# Altium project PCB_Project.PrjPcb
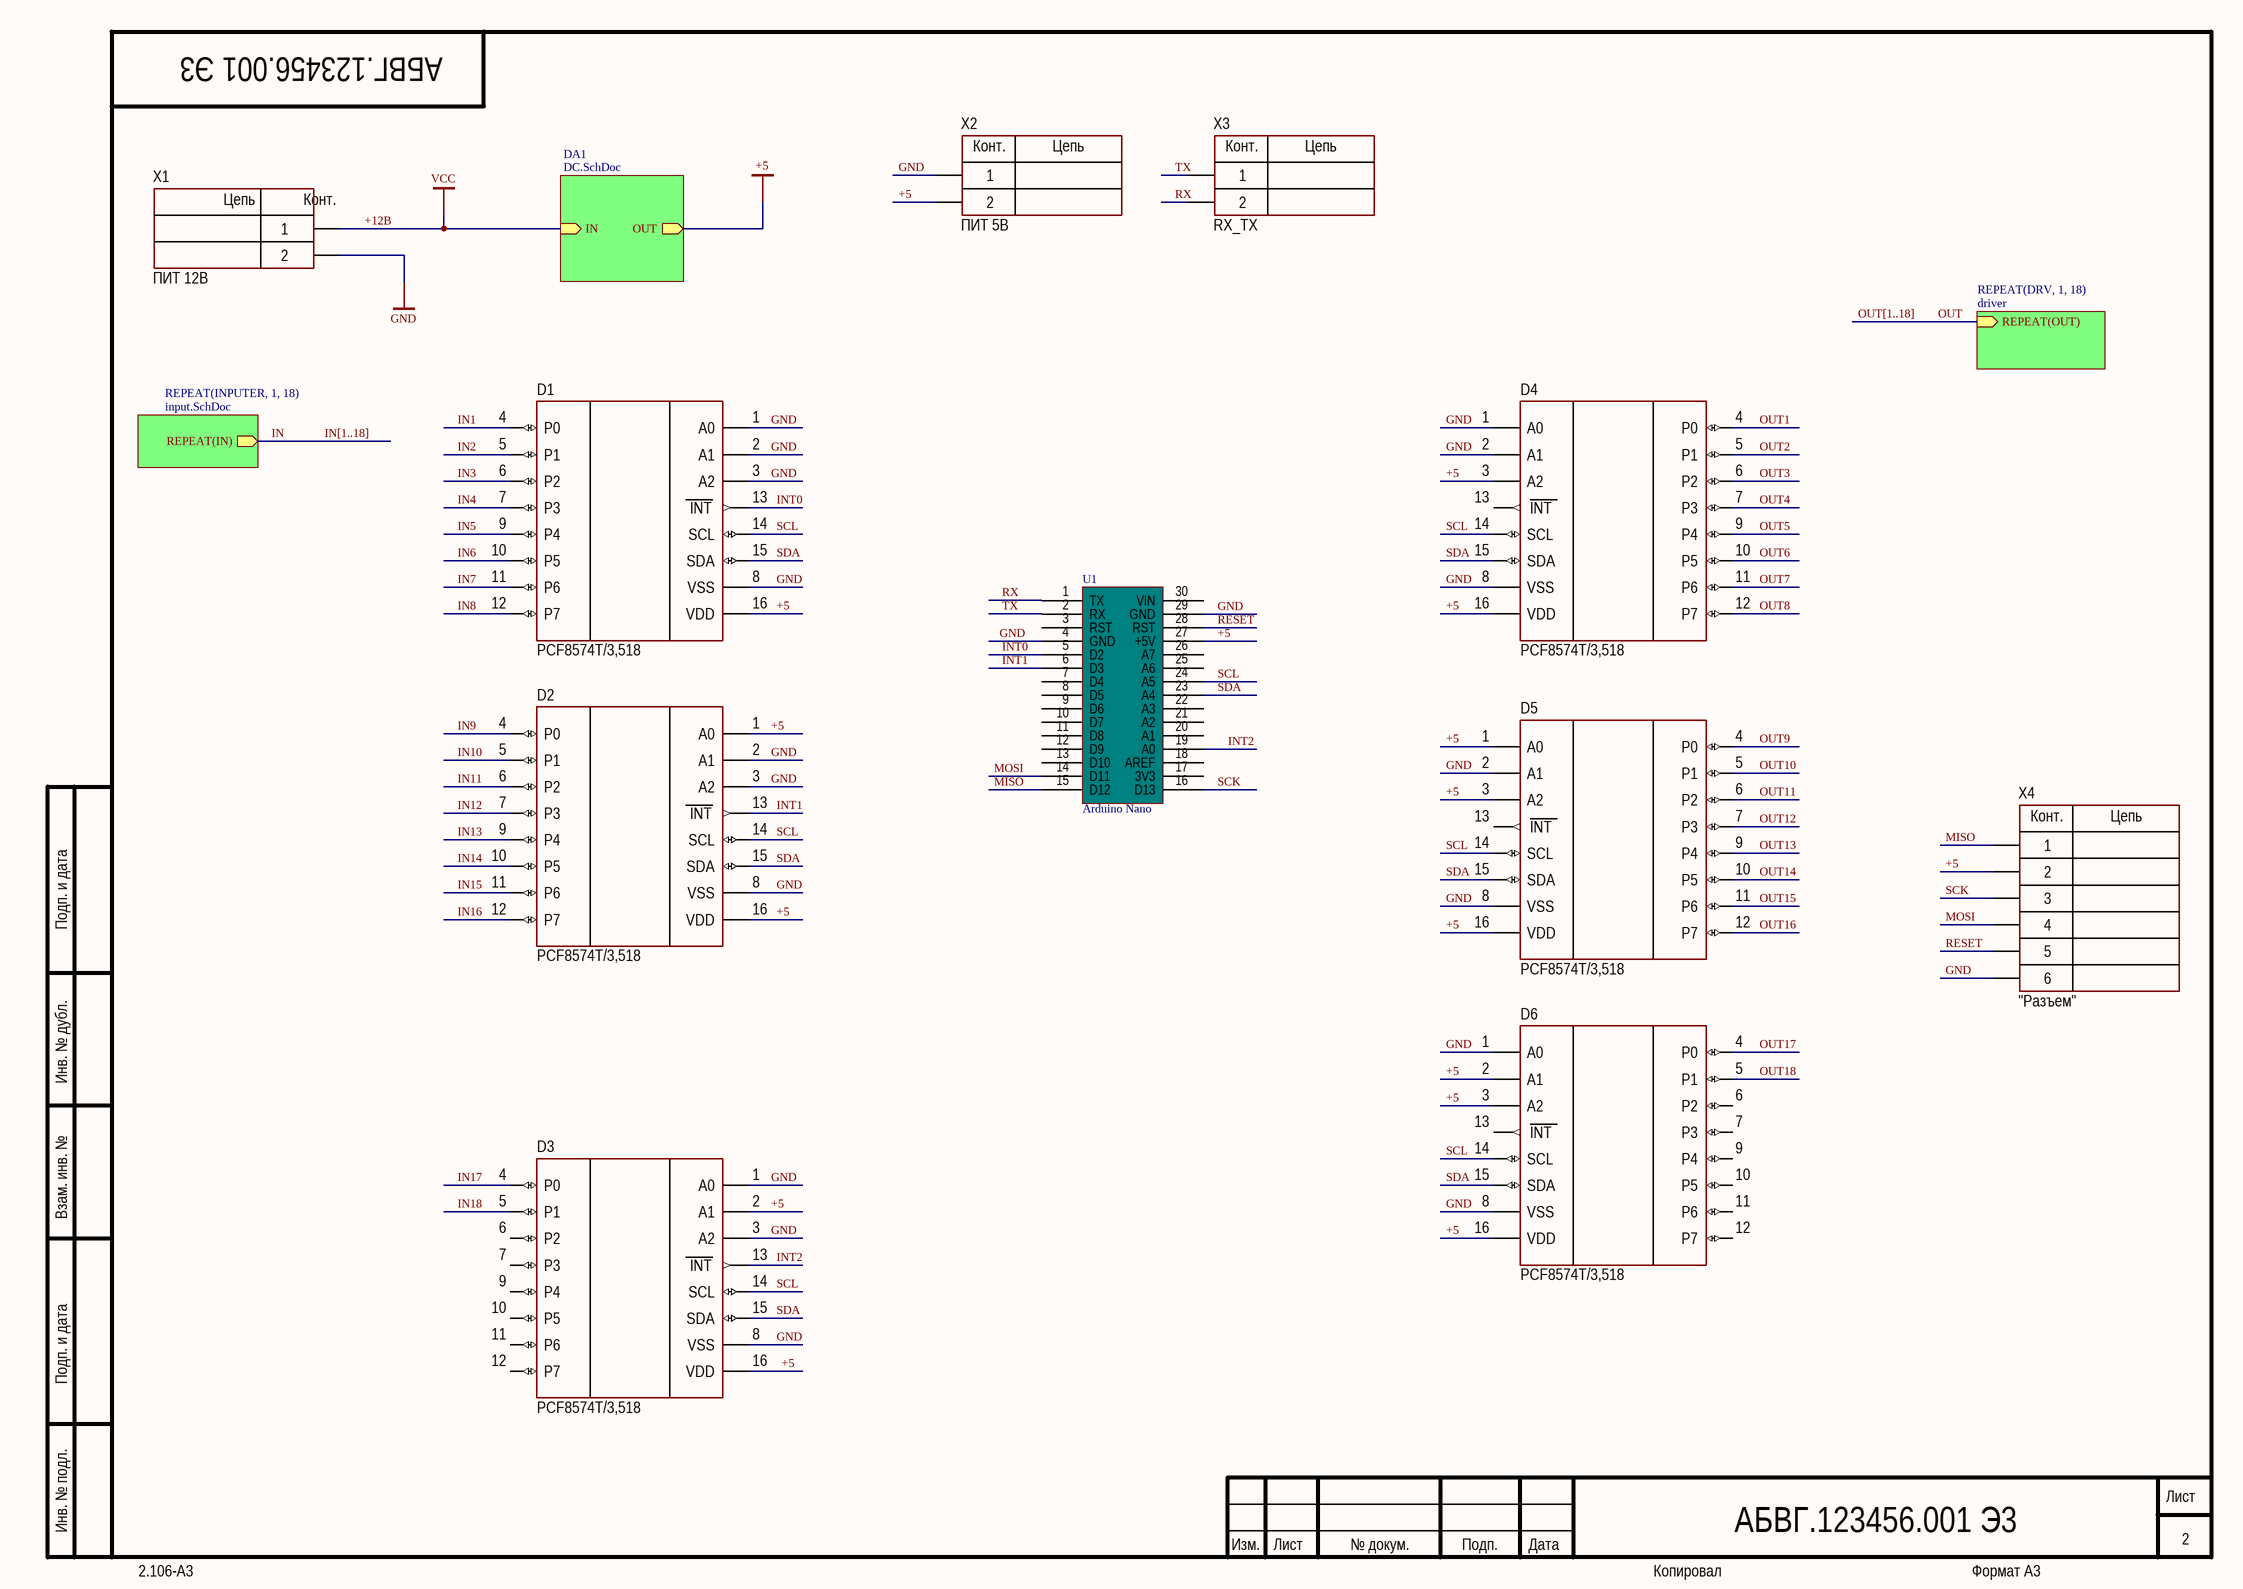
[diagram p0: Sheet1.SchDoc]
4 sheets, 176 parts. Net scope: hierarchical (ports join the sheet entries above them; power ports are global).
Board file: PCB1.PcbDoc
Sheets:
  Sheet1.SchDoc
    DA1 = DC.SchDoc
    INPUTER1 = input.SchDoc
    INPUTER2 = input.SchDoc
    INPUTER3 = input.SchDoc
    INPUTER4 = input.SchDoc
    INPUTER5 = input.SchDoc
    INPUTER6 = input.SchDoc
    INPUTER7 = input.SchDoc
    INPUTER8 = input.SchDoc
    INPUTER9 = input.SchDoc
    INPUTER10 = input.SchDoc
    INPUTER11 = input.SchDoc
    INPUTER12 = input.SchDoc
    INPUTER13 = input.SchDoc
    INPUTER14 = input.SchDoc
    INPUTER15 = input.SchDoc
    INPUTER16 = input.SchDoc
    INPUTER17 = input.SchDoc
    INPUTER18 = input.SchDoc
    DRV1 = driver.SchDoc
    DRV2 = driver.SchDoc
    DRV3 = driver.SchDoc
    DRV4 = driver.SchDoc
    DRV5 = driver.SchDoc
    DRV6 = driver.SchDoc
    DRV7 = driver.SchDoc
    DRV8 = driver.SchDoc
    DRV9 = driver.SchDoc
    DRV10 = driver.SchDoc
    DRV11 = driver.SchDoc
    DRV12 = driver.SchDoc
    DRV13 = driver.SchDoc
    DRV14 = driver.SchDoc
    DRV15 = driver.SchDoc
    DRV16 = driver.SchDoc
    DRV17 = driver.SchDoc
    DRV18 = driver.SchDoc

## Sheet Sheet1.SchDoc
size 420 x 297 mm; Address1: Address1; Address2: Address2; Address3: Address3; Address4: Address4; DocumentNumber: АБВГ.123456.001 Э3; SheetNumber: 2; Scale: 1:1; DocumentType: Схема электрическая принципиальная; FirstReferrence: АБВГ.123456.001

### Parts
D1  PartNumber: PCF8574T/3,518  [16-TSSOP]
D2  PartNumber: PCF8574T/3,518  [16-TSSOP]
D3  PartNumber: PCF8574T/3,518  [16-TSSOP]
D4  PartNumber: PCF8574T/3,518  [16-TSSOP]
D5  PartNumber: PCF8574T/3,518  [16-TSSOP]
D6  PartNumber: PCF8574T/3,518  [16-TSSOP]
U1  Arduino Nano  [CON: ArduinoNano]
X1  CommentText: ПИТ 12В  [TB_2_2.5MM]
X2  CommentText: ПИТ 5В  [TB_2_2.5MM]
X3  CommentText: RX_TX  [TB_2_2.5MM]
X4  CommentText: "Разъем"  [CON: PLD-6]

### Sub-sheets
DA1 = DC.SchDoc: IN (in), OUT (out)
REPEAT(DRV, 1, 18) = driver: REPEAT(OUT) (in)
REPEAT(INPUTER, 1, 18) = input.SchDoc: REPEAT(IN) (out)

### Nets
+5: D1.16(VDD) D2.1(A0) D2.16(VDD) D3.2(A1) D3.16(VDD) D4.3(A2) D4.16(VDD) D5.1(A0) D5.3(A2) D5.16(VDD) D6.2(A1) D6.3(A2) D6.16(VDD) U1.27(+5V) X2.2 X4.2 ; sheet DA1/OUT
+12В: X1.1 ; sheet DA1/IN  [also labelled VCC]
GND: D1.1(A0) D1.2(A1) D1.3(A2) D1.8(VSS) D2.2(A1) D2.3(A2) D2.8(VSS) D3.1(A0) D3.3(A2) D3.8(VSS) D4.1(A0) D4.2(A1) D4.8(VSS) D5.2(A1) D5.8(VSS) D6.1(A0) D6.8(VSS) U1.4(GND) U1.29(GND) X1.2 X2.1 X4.6
IN: sheet REPEAT(INPUTER, 1, 18)/REPEAT(IN)
IN1: D1.4(P0)
IN2: D1.5(P1)
IN3: D1.6(P2)
IN4: D1.7(P3)
IN5: D1.9(P4)
IN6: D1.10(P5)
IN7: D1.11(P6)
IN8: D1.12(P7)
IN9: D2.4(P0)
IN10: D2.5(P1)
IN11: D2.6(P2)
IN12: D2.7(P3)
IN13: D2.9(P4)
IN14: D2.10(P5)
IN15: D2.11(P6)
IN16: D2.12(P7)
IN17: D3.4(P0)
IN18: D3.5(P1)
INT0: D1.13(INT) U1.5(D2)
INT1: D2.13(INT) U1.6(D3)
INT2: D3.13(INT) U1.19(A0)
MISO: U1.15(D12) X4.1
MOSI: U1.14(D11) X4.4
OUT: sheet REPEAT(DRV, 1, 18)/REPEAT(OUT)
OUT1: D4.4(P0)
OUT2: D4.5(P1)
OUT3: D4.6(P2)
OUT4: D4.7(P3)
OUT5: D4.9(P4)
OUT6: D4.10(P5)
OUT7: D4.11(P6)
OUT8: D4.12(P7)
OUT9: D5.4(P0)
OUT10: D5.5(P1)
OUT11: D5.6(P2)
OUT12: D5.7(P3)
OUT13: D5.9(P4)
OUT14: D5.10(P5)
OUT15: D5.11(P6)
OUT16: D5.12(P7)
OUT17: D6.4(P0)
OUT18: D6.5(P1)
RESET: U1.28(RST) X4.5
RX: U1.1(TX) X3.2
SCK: U1.16(D13) X4.3
SCL: D1.14(SCL) D2.14(SCL) D3.14(SCL) D4.14(SCL) D5.14(SCL) D6.14(SCL) U1.24(A5)
SDA: D1.15(SDA) D2.15(SDA) D3.15(SDA) D4.15(SDA) D5.15(SDA) D6.15(SDA) U1.23(A4)
TX: U1.2(RX) X3.1

Not connected (* = marked no-connect by the designer): D3 6(P2) 7(P3) 9(P4) 10(P5) 11(P6) 12(P7); D4 13(INT); D5 13(INT); D6 6(P2) 7(P3) 9(P4) 10(P5) 11(P6) 12(P7) 13(INT); U1 3(RST) 7(D4) 8(D5) 9(D6) 10(D7) 11(D8) 12(D9) 13(D10) 17(3V3) 18(AREF) 20(A1) 21(A2) 22(A3) 25(A6) 26(A7) 30(VIN)

### Buses and harness runs
bus IN[1..18]
bus OUT[1..18]

### Notes on the sheet
- Подп. и дата
- Инв. № дубл.
- Взам. инв. №
- Инв. № подл.
- Изм.
- Лист
- № докум.
- Подп.
- Дата
- 2.106-A3
- Копировал
- Формат А3
- (in symbol DG308-2.54-02P-14-00A(H)) Конт.; Цепь
- (in symbol PLD-6) Конт.; Цепь

### Library data of the parts
D1-D6 = PCF8574T/3,518: Расширитель цифровых входов/выходов для шины I2C; Manufacturer: NXP Semiconductor; ValueManufacturerPartNumber: IC logic buffer, 2...6V, -40...+125°C, 20-TSSOP; Supply: 2...6V; ID: 10; ElementName: PCF8574T/3,518. 8-битный расширитель портов; URL_bying: #https://www.chipdip.ru/product/pcf8574t-3.518?ysclid=luk07hbopc633637602#; HelpURL: https://www.digikey.com/product-detail/en/nexperia-usa-inc/74HC245PW118/1727-4296-1-ND/2209913; Package: 20-TSSOP; ComponentType: IC logic buffer; Temperature: -40...+125°C; Temperature Min: -40; Temperature Max: +85; ValueSCH: PCF8574T/3,518
U1 = Arduino_Nano: ID: 12; ElementName: Ардуино Нано; Partnumber: Arduino_Nano; Manufacturer: Arduino; price: ~200 ₽; ValueSCH: Arduino Nano
X1-X3 = DG308-2.54-02P-14-00A(H): Винтовой клеммный блок c рельефной обоймой, 2 контакта. Серия DG308-2.54; Manufacturer: Китай; ValueManufacturerPartNumber: Terminal connector, 2pin, 3.5mm, 300VAC, 10A; TypeConnector: Terminal connector; VoltageMax: 300VAC; Pitch: 3.5mm; CurrentMax: 10A; Multichannel: 2pin; ID: 6; ElementName: 308-021-14, Клеммник винтовой, 2-контактный, 2.54мм, прямой; ValueSCH: Клемник 308-021-14; ChipDip: #https://www.chipdip.ru/product/308-021-12-14#; HelpURL: https://www.chipdip.ru/product/dg350-3.5-02p-12; PartNumber: DG308-2.54-02P-14-00A(H); Price: 19 ₽; Last_update: 23.11.2020
X4 = PLD-6: Manufacturer: Connfly; ValueManufacturerPartNumber: Connector, 6pin, 2.54mm, 500VAC, 3A; TypeConnector: Connector; VoltageMax: 500VAC; Pitch: 2.54mm; CurrentMax: 3A; Multichannel: 6pin; ID: 7; ElementName: Разъем 6 контактный (3 контакта в 2 ряда); HelpURL: https://www.chipdip.ru/product/pld-6; PartNumber: PLD-6; ValueSCH: PLD-6; Last_update: 30.03.2021

## Sheet DC.SchDoc
size A4
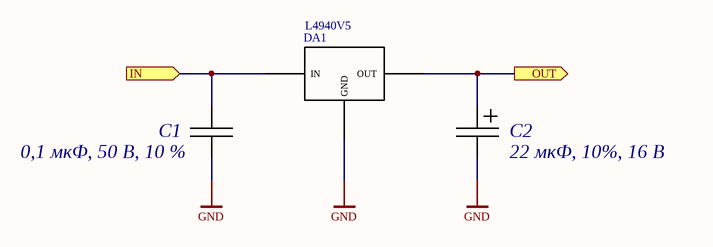
[diagram p1: DC.SchDoc]

### Parts
C1  0,1 мкФ, 50 В, 10 %  [CAP: 0805]
C2  22 мкФ, 10%, 16 В  [CAP: TANTAL-C]
DA1  L4940V5  [TO220_L]

### Ports
IN (in), OUT (out)

### Nets
+5: C2.1 DA1.3(OUT) ; port OUT
+12В: C1.2 DA1.1(IN) ; port IN
GND: C1.1 C2.2 DA1.2(GND)

### Library data of the parts
C1 = GRM21BR71H104K: Конденсатор; Manufacturer: Murata Manufacturing; ValueOther: Value; ID: 19; ChipDip: #https://www.chipdip.ru/product/grm21br71h104k#; ElementName: Кер.ЧИП конд. 0.1 мкФ X7R 50В 10% 0805, GRM21BR71H104K**; ValueSCH: 0,1 мкФ, 50 В, 10 %; Partnumber: GRM21BR71H104K; HelpURL: https://static.chipdip.ru/lib/235/DOC000235066.pdf; Temperature Min: -55; Temperature Max: +125; weight: 0,04; price: 7*10; last_update: 21.11.2020
C2 = TECAP22/16VC10: Конденсатор; Manufacturer: Китай; ID: 35; ChipDip: #https://www.chipdip.ru/product/tecap-22-mkf-16-v-tip-c-10#; ElementName: Конденсатор танталовый SMD, TECAP, 22 мкФ, 16 В, тип C, 10%; Partnumber: TECAP22/16VC10; Temperature Min: -55; Temperature Max: +125; weight: 0,15; price: 44; ValueSCH: 22 мкФ, 10%, 16 В; last_update: 12.10.2023
DA1 = L4940V5_L: LDO регуляторы напряжения 5.0V 1.5A Positive; Manufacturer: STMicroelectronics; ID: 8; ElementName: Линейный стабилизатор напряжения, +5В, 1.5 А, LDO; URL_bying: #https://www.chipdip.ru/product/l4940v5#; Partnumber: L4940V5_L; ValueSCH: L4940V5; Temperature Min: -40; Temperature Max: +150; weight: 2,5; ChipDip: #https://www.chipdip.ru/product/l4940v5#; price: 200; last_update: 12.10.2023

## Sheet input.SchDoc
size A4
Used 18 times, as channels INPUTER1, INPUTER2, INPUTER3, INPUTER4, INPUTER5, INPUTER6, INPUTER7, INPUTER8, INPUTER9, INPUTER10, INPUTER11, INPUTER12, INPUTER13, INPUTER14, INPUTER15, INPUTER16, INPUTER17, INPUTER18. Parts and nets are listed once, with the designators drawn on the sheet.
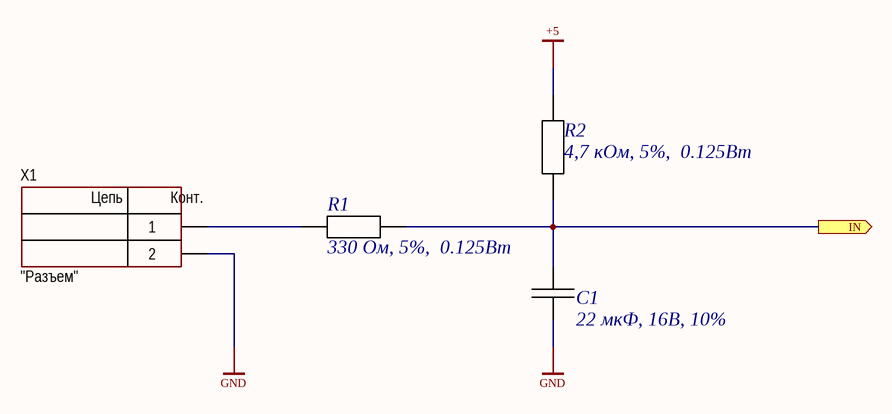
[diagram p2: input.SchDoc]

### Parts
C1  22 мкФ, 16В, 10%  [CAP: 1206]
R1  330 Ом, 5%,  0.125Вт  [RES: 0805]
R2  4,7 кОм, 5%,  0.125Вт  [RES: 0805]
X1  CommentText: "Разъем"  [TB_2_2.5MM]

### Ports
IN (out)

### Nets
+5: R2.2
GND: C1.1 X1.2
IN: C1.2 R1.2 R2.1 ; port IN
NetR1_1: R1.1 X1.1

### Channels
INPUTER1: designators end in _INPUTER1; ports IN=IN1
INPUTER2: designators end in _INPUTER2; ports IN=IN2
INPUTER3: designators end in _INPUTER3; ports IN=IN3
INPUTER4: designators end in _INPUTER4; ports IN=IN4
INPUTER5: designators end in _INPUTER5; ports IN=IN5
INPUTER6: designators end in _INPUTER6; ports IN=IN6
INPUTER7: designators end in _INPUTER7; ports IN=IN7
INPUTER8: designators end in _INPUTER8; ports IN=IN8
INPUTER9: designators end in _INPUTER9; ports IN=IN9
INPUTER10: designators end in _INPUTER10; ports IN=IN10
INPUTER11: designators end in _INPUTER11; ports IN=IN11
INPUTER12: designators end in _INPUTER12; ports IN=IN12
INPUTER13: designators end in _INPUTER13; ports IN=IN13
INPUTER14: designators end in _INPUTER14; ports IN=IN14
INPUTER15: designators end in _INPUTER15; ports IN=IN15
INPUTER16: designators end in _INPUTER16; ports IN=IN16
INPUTER17: designators end in _INPUTER17; ports IN=IN17
INPUTER18: designators end in _INPUTER18; ports IN=IN18

### Notes on the sheet
- (in symbol DG308-2.54-02P-14-00A(H)) Цепь; Конт.

### Library data of the parts
C1 = GRM31CR61C226KE15L: Конденсатор; Manufacturer: Murata Manufacturing; ValueOther: Value; ID: 29; ChipDip: #https://www.chipdip.ru/product/grm31cr61c226ke15l#; ElementName: Кер.ЧИП конд. 22 мкФ X5R 10% 16В 1206, GRM31CR61C226KE15L*; ValueSCH: 22 мкФ, 16В, 10%; Partnumber: GRM31CR61C226KE15L; price: 26*10; last_update: 15.04.2021
R1 = RC0805JR-07330RL: Бескорпусные толстопленочные резисторы; Manufacturer: Тайвань; Value: 100; Power: 0,25; ID: 41; ElementName: Чип резистор (SMD), 330 Ом, 5%, 0.125Вт 0805; ChipDip: #https://www.chipdip.ru/product/0.125w-0805-330-om-5#; MaxVoltage: 150 В; ValueSCH: 330 Ом, 5%,  0.125Вт; Partnumber: RC0805JR-07330RL; Package: 0805; Price: 6*20; Last_update: 12.10.2023
R2 = RC0805JR-074K7L: Бескорпусные толстопленочные резисторы; Manufacturer: Тайвань; Value: 100; Power: 0,25; ID: 42; ElementName: Чип резистор (SMD), 4.7 кОм, 5%, 0.125Вт 0805; ChipDip: #https://www.chipdip.ru/product/0.125w-0805-4.7-kom-5#; MaxVoltage: 150 В; ValueSCH: 4,7 кОм, 5%,  0.125Вт; Partnumber: RC0805JR-074K7L; Package: 0805; Price: 6*20; Last_update: 12.10.2023
X1 = DG308-2.54-02P-14-00A(H): as X1 on sheet Sheet1; HelpURL: https://www.chipdip.ru/product/dg350-3.5-02p-12; PartNumber: DG308-2.54-02P-14-00A(H); Price: 19 ₽; Last_update: 23.11.2020

## Sheet driver.SchDoc
size A4
Used 18 times, as channels DRV1, DRV2, DRV3, DRV4, DRV5, DRV6, DRV7, DRV8, DRV9, DRV10, DRV11, DRV12, DRV13, DRV14, DRV15, DRV16, DRV17, DRV18. Parts and nets are listed once, with the designators drawn on the sheet.
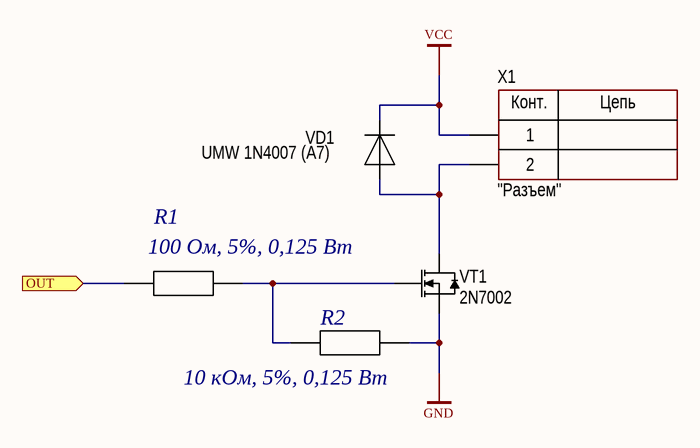
[diagram p3: driver.SchDoc]

### Parts
R1  100 Ом, 5%, 0,125 Вт  [RES: 0805]
R2  10 кОм, 5%, 0,125 Вт  [RES: 0805]
VD1  PartNumber: UMW 1N4007 (A7)  [DIODE: SOD123FL]
VT1  PartNumber: 2N7002  [SOT23]
X1  CommentText: "Разъем"  [TB_2_2.5MM]

### Ports
OUT (in)

### Nets
GND: R2.2 VT1.2(S)
VCC: VD1.2 X1.1
OUT: R1.1 ; port OUT
NetR1_2: R1.2 R2.1 VT1.1(G)
NetVD1_1: VD1.1 VT1.3(D) X1.2

### Channels
DRV1: designators end in _DRV1; ports OUT=OUT1
DRV2: designators end in _DRV2; ports OUT=OUT2
DRV3: designators end in _DRV3; ports OUT=OUT3
DRV4: designators end in _DRV4; ports OUT=OUT4
DRV5: designators end in _DRV5; ports OUT=OUT5
DRV6: designators end in _DRV6; ports OUT=OUT6
DRV7: designators end in _DRV7; ports OUT=OUT7
DRV8: designators end in _DRV8; ports OUT=OUT8
DRV9: designators end in _DRV9; ports OUT=OUT9
DRV10: designators end in _DRV10; ports OUT=OUT10
DRV11: designators end in _DRV11; ports OUT=OUT11
DRV12: designators end in _DRV12; ports OUT=OUT12
DRV13: designators end in _DRV13; ports OUT=OUT13
DRV14: designators end in _DRV14; ports OUT=OUT14
DRV15: designators end in _DRV15; ports OUT=OUT15
DRV16: designators end in _DRV16; ports OUT=OUT16
DRV17: designators end in _DRV17; ports OUT=OUT17
DRV18: designators end in _DRV18; ports OUT=OUT18

### Notes on the sheet
- (in symbol DG308-2.54-02P-14-00A(H)) Конт.; Цепь

### Library data of the parts
R1 = RC0805JR-07100RL: Бескорпусные толстопленочные резисторы (чип-резисторы, smd-резисторы) предназначены для работы в цепях постоянного, переменного и импульсного тока. Используются для поверхностного монтажа.; Manufacturer: Тайвань; Value: 100; Power: 0,25; ID: 35; ElementName: 0.125Вт 0805 100 Ом, 5%, Чип резистор (SMD); ChipDip: #https://www.chipdip.ru/product0/481795709#; MaxVoltage: 150 В; ValueSCH: 100 Ом, 5%, 0,125 Вт; Partnumber: RC0805JR-07100RL; Package: 0805; Price: 2*20; Last_update: 20.11.2020
R2 = RC0805JR-0710KL: Бескорпусные толстопленочные резисторы (чип-резисторы, smd-резисторы) предназначены для работы в цепях постоянного, переменного и импульсного тока. Используются для поверхностного монтажа.; Manufacturer: Тайвань; Value: 100; Power: 0,25; ID: 32; ElementName: 0.125Вт 0805 10 кОм, 5%, Чип резистор (SMD); ChipDip: #https://www.chipdip.ru/product0/528580584#; MaxVoltage: 150 В; ValueSCH: 10 кОм, 5%, 0,125 Вт; Partnumber: RC0805JR-0710KL; Package: 0805; Price: 2; Last_update: 20.11.2020
VD1 = UMW 1N4007 (A7): Manufacturer: UMW (Youtai Semiconductor Co., Ltd.); ValueManufacturerPartNumber: Single diode, 75V, 150mA, 1V, 4ns, SOD-123FL, -55...+150°C; TypeDiode: Single diode; Voltage: 75V; Current: 150mA; VoltageDrop: 1V; RecoveryTime: 4ns; ID: 2; ElementName: Диод 1А 1000В, 1N4007 (A7); ChipDip: #https://www.chipdip.ru/product/1n4007-a7#; MaxVoltage: 1000; Package: SOD-123FL; HelpURL: https://www.digikey.com/product-detail/en/micro-commercial-co/1N4148WX-TP/1N4148WXTPMSCT-ND/717312; Temperature: -55...+150°C; ValueSCH: 1N4007 (A7); Price: 2; Last_update: 12.10.2023
VT1 = 2N7002: MOSFETS-транзистор; Manufacturer: Jiangsu Changjiang Electronics Technology Co., Ltd; ValueManufacturerPartNumber: MOSFET N-channel transistor, 80V, 7A, 9.1nC, 2.5W, 34mOhm, 756pF, 8-TDSON, -55...+150°C; TypeTransistor: MOSFET N-channel transistor; VoltageDS: 80V; CurrentDS: 7A; RDS: 34mOhm; GateCharge: 9.1nC; InputCapacitor: 756pF; MaxPower: 2.5W; ID: 4; ElementName: Транзистор, N-канал, 60В, 0.2А; Package: 8-TDSON; HelpURL: https://www.digikey.com/product-detail/en/infineon-technologies/BSC340N08NS3GATMA1/BSC340N08NS3GATMA1TR-ND/2080655; Temperature: -55...+150°C; URL_bying: https://www.chipdip.ru/product/2n7002-jcet; weight: 0,05; price: 5; ValueSCH: 2N7002
X1 = DG308-2.54-02P-14-00A(H): as X1 on sheet Sheet1; HelpURL: https://www.chipdip.ru/product/dg350-3.5-02p-12; PartNumber: DG308-2.54-02P-14-00A(H); Price: 19 ₽; Last_update: 23.11.2020

## Nets that join several sheets
+5: Sheet1 (16 pins), DC (C2.1 DA1.3), INPUTER1 (R2_INPUTER1.2), INPUTER2 (R2_INPUTER2.2), INPUTER3 (R2_INPUTER3.2), INPUTER4 (R2_INPUTER4.2), INPUTER5 (R2_INPUTER5.2), INPUTER6 (R2_INPUTER6.2), INPUTER7 (R2_INPUTER7.2), INPUTER8 (R2_INPUTER8.2), INPUTER9 (R2_INPUTER9.2), INPUTER10 (R2_INPUTER10.2), INPUTER11 (R2_INPUTER11.2), INPUTER12 (R2_INPUTER12.2), INPUTER13 (R2_INPUTER13.2), INPUTER14 (R2_INPUTER14.2), INPUTER15 (R2_INPUTER15.2), INPUTER16 (R2_INPUTER16.2), INPUTER17 (R2_INPUTER17.2), INPUTER18 (R2_INPUTER18.2)
+12В: Sheet1 (X1.1), DC (C1.2 DA1.1), DRV1 (VD1_DRV1.2 X1_DRV1.1), DRV2 (VD1_DRV2.2 X1_DRV2.1), DRV3 (VD1_DRV3.2 X1_DRV3.1), DRV4 (VD1_DRV4.2 X1_DRV4.1), DRV5 (VD1_DRV5.2 X1_DRV5.1), DRV6 (VD1_DRV6.2 X1_DRV6.1), DRV7 (VD1_DRV7.2 X1_DRV7.1), DRV8 (VD1_DRV8.2 X1_DRV8.1), DRV9 (VD1_DRV9.2 X1_DRV9.1), DRV10 (VD1_DRV10.2 X1_DRV10.1), DRV11 (VD1_DRV11.2 X1_DRV11.1), DRV12 (VD1_DRV12.2 X1_DRV12.1), DRV13 (VD1_DRV13.2 X1_DRV13.1), DRV14 (VD1_DRV14.2 X1_DRV14.1), DRV15 (VD1_DRV15.2 X1_DRV15.1), DRV16 (VD1_DRV16.2 X1_DRV16.1), DRV17 (VD1_DRV17.2 X1_DRV17.1), DRV18 (VD1_DRV18.2 X1_DRV18.1)
GND: Sheet1 (22 pins), DC (C1.1 C2.2 DA1.2), INPUTER1 (C1_INPUTER1.1 X1_INPUTER1.2), INPUTER2 (C1_INPUTER2.1 X1_INPUTER2.2), INPUTER3 (C1_INPUTER3.1 X1_INPUTER3.2), INPUTER4 (C1_INPUTER4.1 X1_INPUTER4.2), INPUTER5 (C1_INPUTER5.1 X1_INPUTER5.2), INPUTER6 (C1_INPUTER6.1 X1_INPUTER6.2), INPUTER7 (C1_INPUTER7.1 X1_INPUTER7.2), INPUTER8 (C1_INPUTER8.1 X1_INPUTER8.2), INPUTER9 (C1_INPUTER9.1 X1_INPUTER9.2), INPUTER10 (C1_INPUTER10.1 X1_INPUTER10.2), INPUTER11 (C1_INPUTER11.1 X1_INPUTER11.2), INPUTER12 (C1_INPUTER12.1 X1_INPUTER12.2), INPUTER13 (C1_INPUTER13.1 X1_INPUTER13.2), INPUTER14 (C1_INPUTER14.1 X1_INPUTER14.2), INPUTER15 (C1_INPUTER15.1 X1_INPUTER15.2), INPUTER16 (C1_INPUTER16.1 X1_INPUTER16.2), INPUTER17 (C1_INPUTER17.1 X1_INPUTER17.2), INPUTER18 (C1_INPUTER18.1 X1_INPUTER18.2), DRV1 (R2_DRV1.2 VT1_DRV1.2), DRV2 (R2_DRV2.2 VT1_DRV2.2), DRV3 (R2_DRV3.2 VT1_DRV3.2), DRV4 (R2_DRV4.2 VT1_DRV4.2), DRV5 (R2_DRV5.2 VT1_DRV5.2), DRV6 (R2_DRV6.2 VT1_DRV6.2), DRV7 (R2_DRV7.2 VT1_DRV7.2), DRV8 (R2_DRV8.2 VT1_DRV8.2), DRV9 (R2_DRV9.2 VT1_DRV9.2), DRV10 (R2_DRV10.2 VT1_DRV10.2), DRV11 (R2_DRV11.2 VT1_DRV11.2), DRV12 (R2_DRV12.2 VT1_DRV12.2), DRV13 (R2_DRV13.2 VT1_DRV13.2), DRV14 (R2_DRV14.2 VT1_DRV14.2), DRV15 (R2_DRV15.2 VT1_DRV15.2), DRV16 (R2_DRV16.2 VT1_DRV16.2), DRV17 (R2_DRV17.2 VT1_DRV17.2), DRV18 (R2_DRV18.2 VT1_DRV18.2)
IN1: Sheet1 (D1.4), INPUTER1 (C1_INPUTER1.2 R1_INPUTER1.2 R2_INPUTER1.1)
IN2: Sheet1 (D1.5), INPUTER2 (C1_INPUTER2.2 R1_INPUTER2.2 R2_INPUTER2.1)
IN3: Sheet1 (D1.6), INPUTER3 (C1_INPUTER3.2 R1_INPUTER3.2 R2_INPUTER3.1)
IN4: Sheet1 (D1.7), INPUTER4 (C1_INPUTER4.2 R1_INPUTER4.2 R2_INPUTER4.1)
IN5: Sheet1 (D1.9), INPUTER5 (C1_INPUTER5.2 R1_INPUTER5.2 R2_INPUTER5.1)
IN6: Sheet1 (D1.10), INPUTER6 (C1_INPUTER6.2 R1_INPUTER6.2 R2_INPUTER6.1)
IN7: Sheet1 (D1.11), INPUTER7 (C1_INPUTER7.2 R1_INPUTER7.2 R2_INPUTER7.1)
IN8: Sheet1 (D1.12), INPUTER8 (C1_INPUTER8.2 R1_INPUTER8.2 R2_INPUTER8.1)
IN9: Sheet1 (D2.4), INPUTER9 (C1_INPUTER9.2 R1_INPUTER9.2 R2_INPUTER9.1)
IN10: Sheet1 (D2.5), INPUTER10 (C1_INPUTER10.2 R1_INPUTER10.2 R2_INPUTER10.1)
IN11: Sheet1 (D2.6), INPUTER11 (C1_INPUTER11.2 R1_INPUTER11.2 R2_INPUTER11.1)
IN12: Sheet1 (D2.7), INPUTER12 (C1_INPUTER12.2 R1_INPUTER12.2 R2_INPUTER12.1)
IN13: Sheet1 (D2.9), INPUTER13 (C1_INPUTER13.2 R1_INPUTER13.2 R2_INPUTER13.1)
IN14: Sheet1 (D2.10), INPUTER14 (C1_INPUTER14.2 R1_INPUTER14.2 R2_INPUTER14.1)
IN15: Sheet1 (D2.11), INPUTER15 (C1_INPUTER15.2 R1_INPUTER15.2 R2_INPUTER15.1)
IN16: Sheet1 (D2.12), INPUTER16 (C1_INPUTER16.2 R1_INPUTER16.2 R2_INPUTER16.1)
IN17: Sheet1 (D3.4), INPUTER17 (C1_INPUTER17.2 R1_INPUTER17.2 R2_INPUTER17.1)
IN18: Sheet1 (D3.5), INPUTER18 (C1_INPUTER18.2 R1_INPUTER18.2 R2_INPUTER18.1)
OUT1: Sheet1 (D4.4), DRV1 (R1_DRV1.1)
OUT2: Sheet1 (D4.5), DRV2 (R1_DRV2.1)
OUT3: Sheet1 (D4.6), DRV3 (R1_DRV3.1)
OUT4: Sheet1 (D4.7), DRV4 (R1_DRV4.1)
OUT5: Sheet1 (D4.9), DRV5 (R1_DRV5.1)
OUT6: Sheet1 (D4.10), DRV6 (R1_DRV6.1)
OUT7: Sheet1 (D4.11), DRV7 (R1_DRV7.1)
OUT8: Sheet1 (D4.12), DRV8 (R1_DRV8.1)
OUT9: Sheet1 (D5.4), DRV9 (R1_DRV9.1)
OUT10: Sheet1 (D5.5), DRV10 (R1_DRV10.1)
OUT11: Sheet1 (D5.6), DRV11 (R1_DRV11.1)
OUT12: Sheet1 (D5.7), DRV12 (R1_DRV12.1)
OUT13: Sheet1 (D5.9), DRV13 (R1_DRV13.1)
OUT14: Sheet1 (D5.10), DRV14 (R1_DRV14.1)
OUT15: Sheet1 (D5.11), DRV15 (R1_DRV15.1)
OUT16: Sheet1 (D5.12), DRV16 (R1_DRV16.1)
OUT17: Sheet1 (D6.4), DRV17 (R1_DRV17.1)
OUT18: Sheet1 (D6.5), DRV18 (R1_DRV18.1)